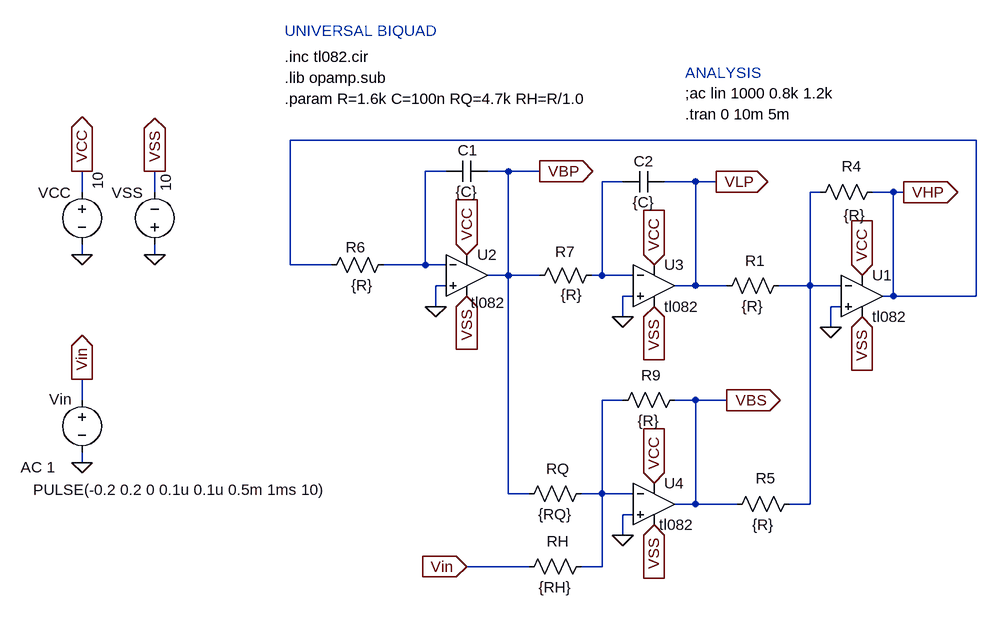
[diagram p0: schematic Universal_Biquad_tl082.asc]
Universal_Biquad_tl082.asc, the LTspice schematic file:
Version 4
SHEET 1 1496 860
WIRE 1296 -48 240 -48
WIRE 480 0 448 0
WIRE 576 0 544 0
WIRE 624 0 576 0
WIRE 752 16 720 16
WIRE 864 16 816 16
WIRE 896 16 864 16
WIRE -80 32 -80 0
WIRE 32 32 32 0
WIRE 1056 32 1040 32
WIRE 1168 32 1136 32
WIRE 1184 32 1168 32
WIRE -80 128 -80 112
WIRE 32 128 32 112
WIRE 240 144 240 -48
WIRE 304 144 240 144
WIRE 448 144 448 0
WIRE 448 144 384 144
WIRE 480 144 448 144
WIRE 576 160 576 0
WIRE 576 160 544 160
WIRE 624 160 576 160
WIRE 720 160 720 16
WIRE 720 160 704 160
WIRE 768 160 720 160
WIRE 480 176 464 176
WIRE 864 176 864 16
WIRE 864 176 832 176
WIRE 912 176 864 176
WIRE 1040 176 1040 32
WIRE 1040 176 992 176
WIRE 1088 176 1040 176
WIRE 768 192 752 192
WIRE 1168 192 1168 32
WIRE 1168 192 1152 192
WIRE 1296 192 1296 -48
WIRE 1296 192 1168 192
WIRE 464 208 464 176
WIRE 1088 208 1072 208
WIRE 752 224 752 192
WIRE 1072 240 1072 208
WIRE -80 352 -80 320
WIRE 752 352 720 352
WIRE 864 352 832 352
WIRE 912 352 864 352
WIRE -80 448 -80 432
WIRE 576 496 576 160
WIRE 608 496 576 496
WIRE 720 496 720 352
WIRE 720 496 688 496
WIRE 768 496 720 496
WIRE 864 512 864 352
WIRE 864 512 832 512
WIRE 928 512 864 512
WIRE 1040 512 1040 176
WIRE 1040 512 1008 512
WIRE 768 528 752 528
WIRE 752 560 752 528
WIRE 608 608 512 608
WIRE 720 608 720 496
WIRE 720 608 688 608
FLAG 464 208 0
FLAG 752 224 0
FLAG 32 128 0
FLAG -80 128 0
FLAG 512 128 VCC
IOPIN 512 128 In
FLAG 512 192 VSS
IOPIN 512 192 In
FLAG 512 608 Vin
IOPIN 512 608 In
FLAG 1184 32 VHP
IOPIN 1184 32 Out
FLAG 624 0 VBP
IOPIN 624 0 Out
FLAG 896 16 VLP
IOPIN 896 16 Out
FLAG -80 0 VCC
IOPIN -80 0 Out
FLAG 32 0 VSS
IOPIN 32 0 Out
FLAG -80 320 Vin
IOPIN -80 320 Out
FLAG -80 448 0
FLAG 800 544 VSS
IOPIN 800 544 In
FLAG 800 480 VCC
IOPIN 800 480 In
FLAG 1072 240 0
FLAG 752 560 0
FLAG 912 352 VBS
IOPIN 912 352 Out
FLAG 800 144 VCC
IOPIN 800 144 In
FLAG 1120 160 VCC
IOPIN 1120 160 In
FLAG 800 208 VSS
IOPIN 800 208 In
FLAG 1120 224 VSS
IOPIN 1120 224 In
SYMBOL res 1152 16 R90
WINDOW 0 -8 48 VBottom 2
WINDOW 3 36 43 VTop 2
SYMATTR InstName R4
SYMATTR Value {R}
SYMBOL res 400 128 R90
WINDOW 0 11 -263 VBottom 2
WINDOW 3 32 49 VTop 2
SYMATTR InstName R7
SYMATTR Value {R}
SYMATTR SpiceLine tol=1 pwr=0.1
SYMBOL res 720 144 R90
WINDOW 0 -12 379 VBottom 2
WINDOW 3 30 47 VTop 2
SYMATTR InstName R6
SYMATTR Value {R}
SYMBOL res 1024 496 R90
WINDOW 0 -8 52 VBottom 2
WINDOW 3 32 56 VTop 2
SYMATTR InstName R5
SYMATTR Value {R}
SYMBOL cap 544 -16 R90
WINDOW 0 -1 31 VBottom 2
WINDOW 3 32 32 VTop 2
SYMATTR InstName C1
SYMATTR Value {C}
SYMBOL cap 816 0 R90
WINDOW 0 0 32 VBottom 2
WINDOW 3 32 32 VTop 2
SYMATTR InstName C2
SYMATTR Value {C}
SYMBOL voltage -80 336 R0
WINDOW 123 -41 119 Right 2
WINDOW 39 0 0 Left 2
WINDOW 0 -16 15 Right 2
WINDOW 3 377 154 Right 2
SYMATTR Value2 AC 1
SYMATTR InstName Vin
SYMATTR Value PULSE(-0.2 0.2 0 0.1u 0.1u 0.5m 1ms 10)
SYMBOL voltage -80 16 R0
WINDOW 0 -17 17 Right 2
WINDOW 3 24 -15 VRight 2
WINDOW 123 0 0 Left 2
WINDOW 39 0 0 Left 2
SYMATTR InstName VCC
SYMATTR Value 10
SYMBOL voltage 32 128 R180
WINDOW 0 19 95 Left 2
WINDOW 3 -17 97 VRight 2
WINDOW 123 0 0 Left 2
WINDOW 39 0 0 Left 2
SYMATTR InstName VSS
SYMATTR Value 10
SYMBOL Opamps\\opamp2 1120 128 R0
SYMATTR InstName U1
SYMATTR Value tl082
SYMBOL Opamps\\opamp2 512 96 R0
WINDOW 3 6 106 Left 2
SYMATTR Value tl082
SYMATTR InstName U2
SYMBOL Opamps\\opamp2 800 112 R0
SYMATTR InstName U3
SYMATTR Value tl082
SYMBOL Opamps\\opamp2 800 448 R0
WINDOW 3 8 96 Left 2
SYMATTR Value tl082
SYMATTR InstName U4
SYMBOL res 704 480 R90
WINDOW 0 -7 52 VBottom 2
WINDOW 3 32 56 VTop 2
SYMATTR InstName RQ
SYMATTR Value {RQ}
SYMBOL res 848 336 R90
WINDOW 0 -7 52 VBottom 2
WINDOW 3 32 56 VTop 2
SYMATTR InstName R9
SYMATTR Value {R}
SYMBOL res 1008 160 R90
WINDOW 0 -7 52 VBottom 2
WINDOW 3 32 56 VTop 2
SYMATTR InstName R1
SYMATTR Value {R}
SYMBOL res 704 592 R90
WINDOW 0 -7 52 VBottom 2
WINDOW 3 32 56 VTop 2
SYMATTR InstName RH
SYMATTR Value {RH}
TEXT 848 -120 Left 2 !;ac lin 1000 0.8k 1.2k
TEXT 232 -144 Left 2 !.lib opamp.sub
TEXT 232 -176 Left 2 !.inc tl082.cir
TEXT 232 -112 Left 2 !.param R=1.6k C=100n RQ=4.7k RH=R/1.0
TEXT 848 -152 Left 2 ;ANALYSIS
TEXT 232 -216 Left 2 ;UNIVERSAL BIQUAD
TEXT 848 -88 Left 2 !.tran 0 10m 5m

The netlist it stands for:
* Universal_Biquad_tl082.asc
R4 VHP N003 {R}
R7 N001 VHP {R} tol=1 pwr=0.1
R6 N002 VBP {R}
R5 N003 VBS {R}
C1 VBP N001 {C}
C2 VLP N002 {C}
Vin Vin 0 PULSE(-0.2 0.2 0 0.1u 0.1u 0.5m 1ms 10) AC 1
VCC VCC 0 10
VSS 0 VSS 10
XU1 0 N003 VCC VSS VHP tl082  ; pins In+ In- V+ V- OUT
XU2 0 N001 VCC VSS VBP tl082  ; pins In+ In- V+ V- OUT
XU3 0 N002 VCC VSS VLP tl082  ; pins In+ In- V+ V- OUT
XU4 0 N004 VCC VSS VBS tl082  ; pins In+ In- V+ V- OUT
RQ N004 VBP {RQ}
R9 VBS N004 {R}
R1 N003 VLP {R}
RH N004 Vin {RH}
;ac lin 1000 0.8k 1.2k
.lib opamp.sub
.inc tl082.cir
.param R=1.6k C=100n RQ=4.7k RH=R/1.0
* ANALYSIS
* UNIVERSAL BIQUAD
.tran 0 10m 5m
.backanno
.end